# Altium schematic sheet OBCComms.SchDoc
size 274 x 210 mm
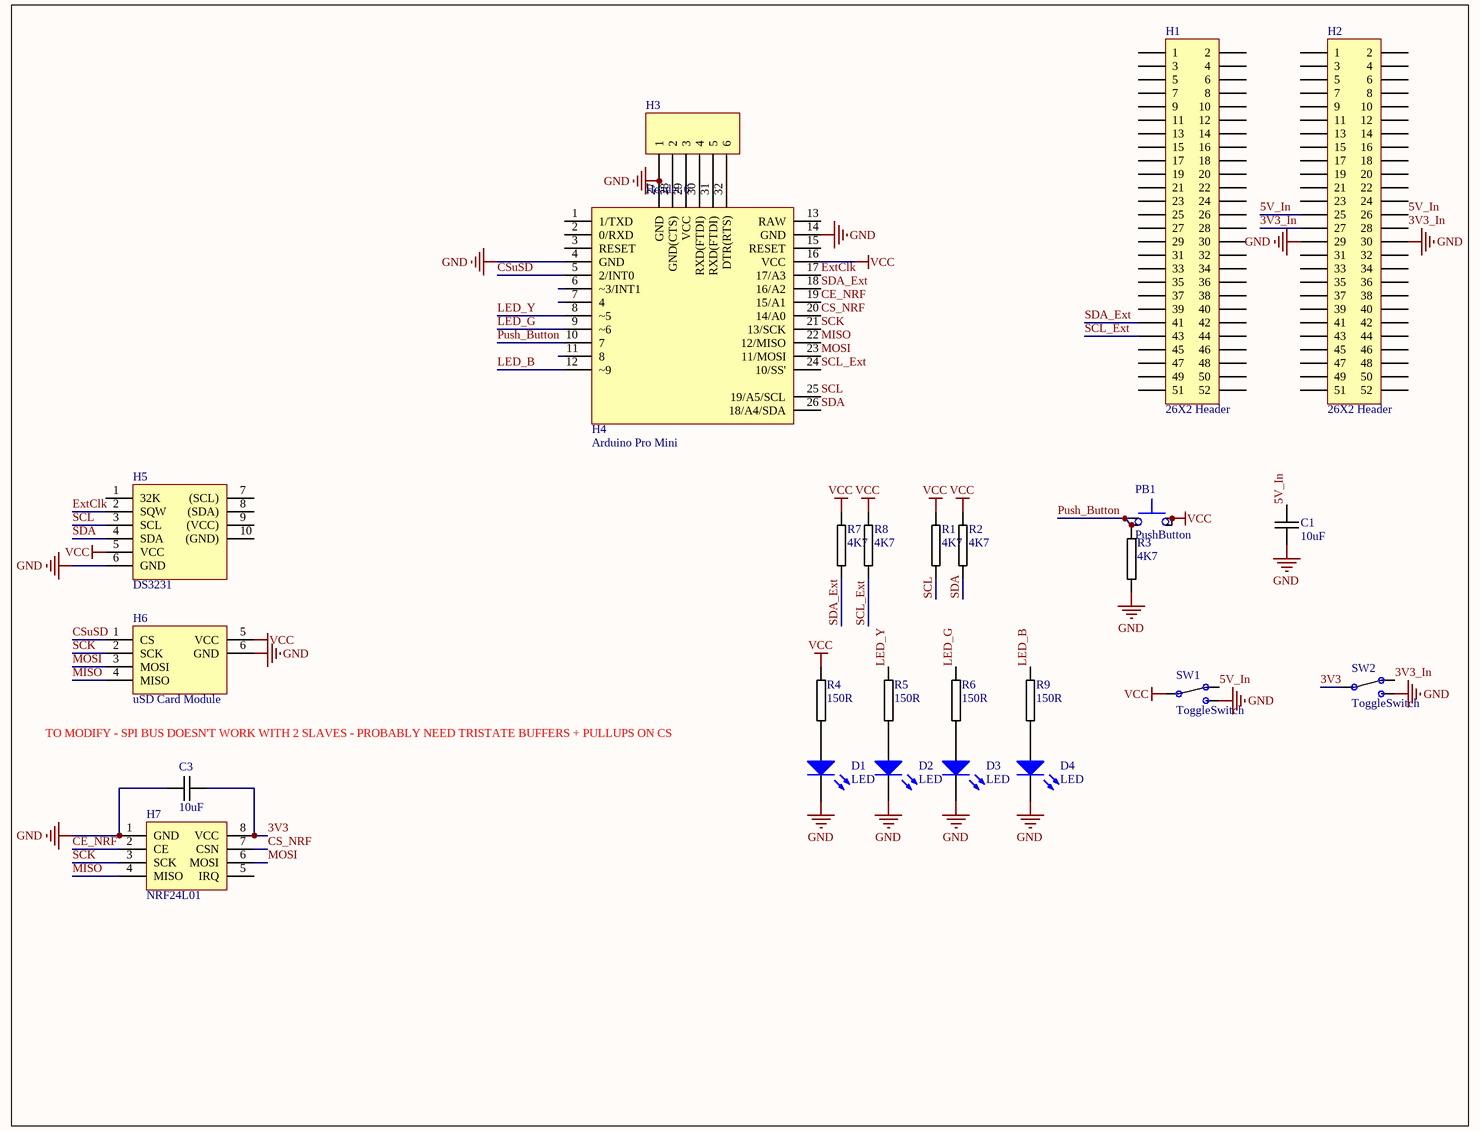
[diagram p0: OBCComms.SchDoc]

## Parts
C1  10uF  [0805C-TBD]
C3  10uF  [0805C-GENERIC]
D1  LED  [LED]
D2  LED  [LED]
D3  LED  [LED]
D4  LED  [LED]
H1  26X2 Header  [26X2 Header]
H2  26X2 Header  [26X2 Header]
H3  Header 6  [HDR1X6]
H4  Arduino Pro Mini  [Arduino Pro Mini]
H5  DS3231  [RTC]
H6  uSD Card Module  [uSD Card Module]
H7  NRF24L01  [NRF24L01]
PB1  PushButton  [PushButton]
R1  4K7  [0805R-4K7]
R2  4K7  [0805R-4K7]
R3  4K7  [0805R-4K7]
R4  150R  [0805R-150]
R5  150R  [0805R-150]
R6  150R  [0805R-150]
R7  4K7  [0805R-4K7]
R8  4K7  [0805R-4K7]
R9  150R  [0805R-150]
SW1  ToggleSwitch  [SWITCHFOOTPRINT]
SW2  ToggleSwitch  [SWITCHFOOTPRINT]

## Nets
GND: C1.2 C3.1 D1.2(K) D2.2(K) D3.2(K) D4.2(K) H2.29 H2.30 H3.1 H4.4(GND) H4.14(GND) H4.27(GND) H5.6(GND) H6.6(GND) H7.1(GND) R3.2 SW1.25 SW2.25
VCC: H4.16(VCC) H5.5(VCC) H6.5(VCC) PB1.27 PB1.29 R1.1 R2.1 R4.1 R7.1 R8.1 SW1.23
3V3: C3.2 H7.8(VCC) SW2.23
3V3_In: H2.27 H2.28 SW2.24
5V_In: C1.1 H2.25 H2.26 SW1.24
CE_NRF: H4.19(15/A1) H7.2(CE)
CS_NRF: H4.20(14/A0) H7.7(CSN)
CSuSD: H4.5(2/INT0) H6.1(CS)
ExtClk: H4.17(17/A3) H5.2(SQW)
LED_B: H4.12(~9) R9.1
LED_G: H4.9(~6) R6.1
LED_Y: H4.8(~5) R5.1
MISO: H4.22(12/MISO) H6.4(MISO) H7.4(MISO)
MOSI: H4.23(11/MOSI) H6.3(MOSI) H7.6(MOSI)
Push_Button: H4.10(7) PB1.26 PB1.28 R3.1
SCK: H4.21(13/SCK) H6.2(SCK) H7.3(SCK)
SCL: H4.25(19/A5/SCL) H5.3(SCL) R1.2
SCL_Ext: H1.43 H4.24(10/SS') R8.2
SDA: H4.26(18/A4/SDA) H5.4(SDA) R2.2
SDA_Ext: H1.41 H4.18(16/A2) R7.2
NetD1_1: D1.1(A) R4.2
NetD2_1: D2.1(A) R5.2
NetD3_1: D3.1(A) R6.2
NetD4_1: D4.1(A) R9.2
NetH3_2: H3.2 H4.28(GND(CTS))
NetH3_3: H3.3 H4.29(VCC)
NetH3_4: H3.4 H4.30(RXD(FTDI))
NetH3_5: H3.5 H4.31(RXD(FTDI))
NetH3_6: H3.6 H4.32(DTR(RTS))

Not connected (* = marked no-connect by the designer): H1 1 2 3 4 5 6 7 8 9 10 11 12 13 14 15 16 17 18 19 20 21 22 23 24 25 26 27 28 29 30 31 32 33 34 35 36 37 38 39 40 42 44 45 46 47 48 49 50 51 52; H2 1 2 3 4 5 6 7 8 9 10 11 12 13 14 15 16 17 18 19 20 21 22 23 24 31 32 33 34 35 36 37 38 39 40 41 42 43 44 45 46 47 48 49 50 51 52; H4 1(1/TXD) 2(0/RXD) 3(RESET) 6(~3/INT1) 7(4) 11(8) 13(RAW) 15(RESET); H5 1(32K) 7((SCL)) 8((SDA)) 9((VCC)) 10((GND)); H7 5(IRQ)

## Notes on the sheet
- TO MODIFY - SPI BUS DOESN'T WORK WITH 2 SLAVES - PROBABLY NEED TRISTATE BUFFERS + PULLUPS ON CS

## Library data of the parts
C1 = 0805C-100nF-25V-X7R-MUR: CAPACITOR 0805 CERAMIC; Supplier 1: Digi-Key; Supplier Part Number 1: 490-1673-1-ND
C3 = 0805C-10UF-16V-X5R-TDK: CAPACITOR 0805 CERAMIC; Manufacturer Part Number: C2012X5R1C106M; Manufacturer: TDK Corporation; REEL: C63; Supplier 1: Digi-Key; Supplier Part Number 1: 445-4115-2-ND
D1-D4 = LED: Small LED
H3 = Header 6: Header, 6-Pin; LatestRevisionDate: 17-Jul-2002; LatestRevisionNote: Re-released for DXP Platform.; Publisher: Altium Limited
H5 = DS3231: RTC
H7 = NRF24L01: Radio Transceiver
PB1 = PushButton: pin to pad: 26>5 27>7 28>6 29>8
R1-R3 R7 R8 = 0805R-4K7: RESISTOR 0805 1/4 WATT THIN FILM; Reel: *
R4-R6 R9 = 0805R-150: RESISTOR 0805 1/4 WATT THIN FILM; Reel: *
SW1 SW2 = ToggleSwitch: pin to pad: 23>3 24>2 25>4